# Altium schematic sheet Proyecto_Multicapa_Schematic_3.SchDoc
size Letter; SheetNumber: 3; SheetTotal: 3
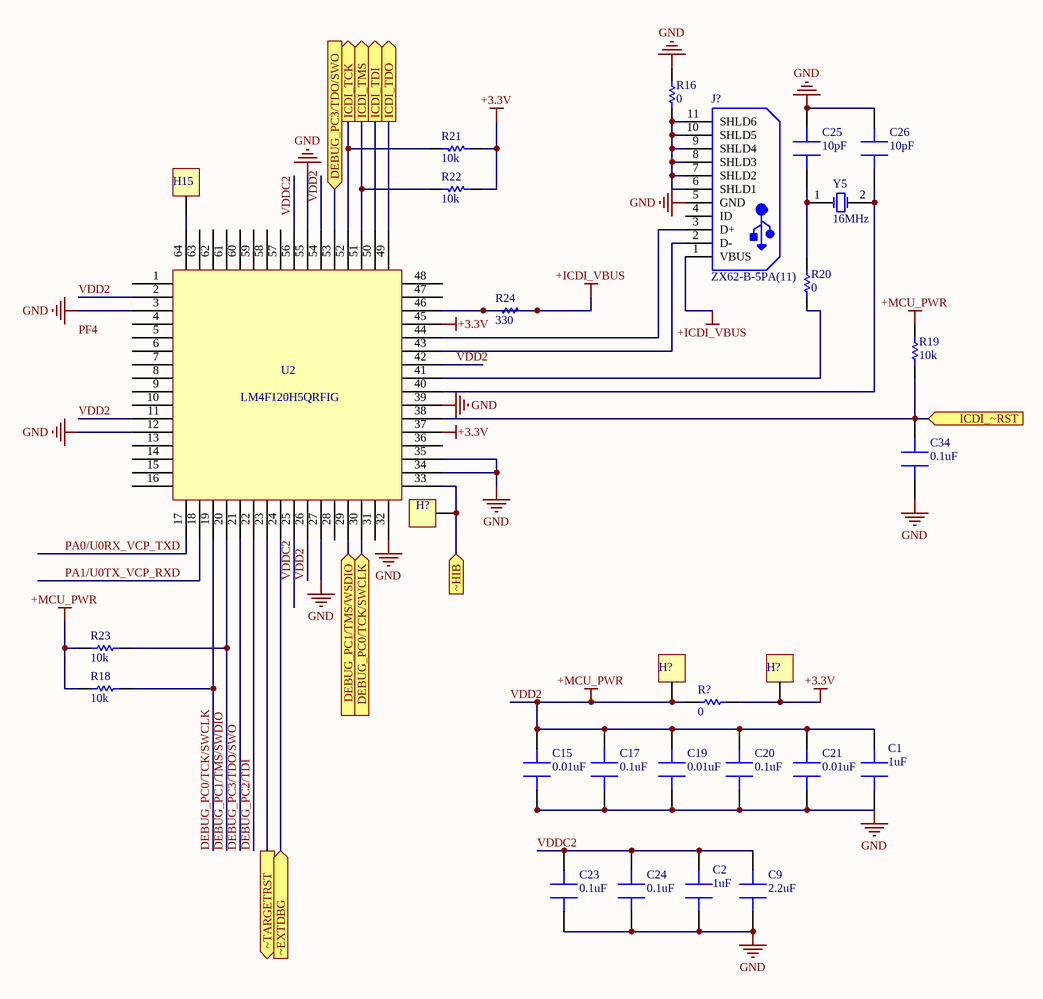
[diagram p0: Proyecto_Multicapa_Schematic_3.SchDoc]

## Parts
(Parts that share a designator on the sheet are numbered #1, #2 ... from top to bottom, then left to right.)
C1  1uF  [C0402]
C2  1uF  [C0402]
C9  2.2uF  [C0603]
C15  0.01uF  [C0402]
C17  0.1uF  [C0402]
C19  0.01uF  [C0402]
C20  0.1uF  [C0402]
C21  0.01uF  [C0402]
C23  0.1uF  [C0402]
C24  0.1uF  [C0402]
C25  10pF  [C0402]
C26  10pF  [C0402]
C34  0.1uF  [C0402]
H15  HDR1  [HDR 1X1]  (value not drawn)
H?#1  HDR1  [HDR 1X1]  (value not drawn)
H?#2  HDR1  [HDR 1X1]  (value not drawn)
H?#3  HDR1  [HDR 1X1]  (value not drawn)
J?  ZX62-B-5PA(11)  [HIRO-ZX62-B-5PA_V]
R16  0  [Resis 1M]
R18  10k  [Resis 1M]
R19  10k  [Resis 1M]
R20  0  [Resis 1M]
R21  10k  [Resis 1M]
R22  10k  [Resis 1M]
R23  10k  [Resis 1M]
R24  330  [Resis 1M]
R?  0  [Resis 1M]
U2  LM4F120H5QRFIG  [LM4F120H5QRFIG]  (value not drawn)
Y5  16MHz  [Crystal 16Mhz]

## Ports
DEBUG_PC0/TCK/SWCLK (in), DEBUG_PC1/TMS/WSDIO (in), DEBUG_PC3/TDO/SWO (in), ICDI_TCK (out), ICDI_TDI (out), ICDI_TDO (out), ICDI_TMS (out), ICDI_~RST (in), ~EXTDBG (in), ~HIB (in), ~TARGETRST (out)

## Nets
+3.3V: H?#3.1 R21.1 R22.1 R?.2 U2.37 U2.45
+ICDI_VBUS: J?.1(VBUS) R24.1 R24.2 U2.46
GND: C1.0 C2.0 C9.0 C15.0 C17.0 C19.0 C20.0 C21.0 C23.0 C24.0 C25.1 C26.1 C34.0 J?.5(GND) R16.1 U2.3 U2.12 U2.27 U2.32 U2.34 U2.35 U2.39 U2.55
VDD2: C1.1 C15.1 C17.1 C19.1 C20.1 C21.1 H?#2.1 R18.1 R19.2 R23.1 R?.1 U2.2 U2.11 U2.26 U2.42 U2.54  [also labelled +MCU_PWR]
DEBUG_PC0/TCK/SWCLK: R18.2 U2.19
DEBUG_PC0/TCK/SWCLK: U2.30 ; port DEBUG_PC0/TCK/SWCLK  [a separate net that carries the same name]
DEBUG_PC1/TMS/SWDIO: R23.2 U2.20
DEBUG_PC1/TMS/WSDIO: U2.29 ; port DEBUG_PC1/TMS/WSDIO
DEBUG_PC2/TDI: U2.22
DEBUG_PC3/TDO/SWO: U2.21
DEBUG_PC3/TDO/SWO: U2.53 ; port DEBUG_PC3/TDO/SWO  [a separate net that carries the same name]
ICDI_TCK: R21.2 U2.52 ; port ICDI_TCK
ICDI_TDI: U2.50 ; port ICDI_TDI
ICDI_TDO: U2.49 ; port ICDI_TDO
ICDI_TMS: R22.2 U2.51 ; port ICDI_TMS
ICDI_~RST: C34.1 R19.1 U2.38 ; port ICDI_~RST
PA0/U0RX_VCP_TXD: U2.17
PA1/U0TX_VCP_RXD: U2.18
VDDC2: C2.1 C9.1 C23.1 C24.1 U2.25 U2.56
~EXTDBG: U2.24 ; port ~EXTDBG
~HIB: H?#1.1 U2.33 ; port ~HIB
~TARGETRST: U2.23 ; port ~TARGETRST
NetC25_0: C25.0 R20.2 Y5.1(OSC1)
NetC26_0: C26.0 U2.40 Y5.2(OSC2)
NetH15_1: H15.1 U2.64
NetJ?_2: J?.2(D-) U2.43
NetJ?_3: J?.3(D+) U2.44
NetJ?_6: J?.6(SHLD1) J?.7(SHLD2) J?.8(SHLD3) J?.9(SHLD4) J?.10(SHLD5) J?.11(SHLD6) R16.2
NetR20_1: R20.1 U2.41

Not connected (* = marked no-connect by the designer): J? 4(ID); U2 1 4 5 6 7 8 9 10 13 14 15 16 28 31 36 47 48 57 58 59 60 61 62 63

## Notes on the sheet
- Labels drawn without touching a wire or pin: PF4
- Project:
- Page content:
- Revision:
- Size:
- Letter
- Design:
- Document Number:
- Date:
- Sheet:
- of

## Library data of the parts
C1 C2 = 100R07X105KV4T: Multilayer Ceramic Capacitor, Tanceram Series, 1 - F, - 10%, X5R, 10 V, 0402 [1005 Metric]; Manufacturer: Johanson; Voltage Rating: 10V; Supplier 1: Mouser; Manufacturer Part Number: 100R07X105KV4T; Stock 1: 61365; Pricing 1: 1 = 0.28000, 10 = 0.19300, 50 = 0.19300, 100 = 0.09800, 500 = 0.06700, 1000 = 0.06000, 2500 = 0.05700, 5000 = 0.05200, 10000 = 0.04800 (USD); RoHS: Yes; Mount: Surface Mount; Case/Package: 0402; Number of Pins: 2; Case Code (Metric): 1005; Case Code (Imperial): 0402; Weight: 2.3E-05oz; Min Operating Temperature: -55°C; Max Operating Temperature: 85°C; Capacitance: 1uF; Tolerance: 10%; Packaging: Tape and Reel; Package Quantity: 10000; Voltage Rating (DC): 10V; Dielectric: X5R; Termination: SMD/SMT; Series: TANCERAM®; Length: 1.02mm; Width: 0.02inch; Height: 0.64mm; Thickness: 0.025inch; Depth: 0.51mm; Radiation Hardening: No; REACH SVHC: No SVHC; RoHS Compliant: Yes; ComponentLink1URL: https://datasheet.ciiva.com/26948/getdatasheetpartid-789067-26948543.pdf?src-supplier=Verical; ComponentLink1Description: https://datasheet.ciiva.com/26948/getdatasheetpartid-789067-26948543.pdf?src-supplier=Verical; ComponentLink2URL: https://datasheet.ciiva.com/22693/jdi-full-catalog-2012-01-22693744.pdf?src-supplier=Element14; ComponentLink2Description: https://datasheet.ciiva.com/22693/jdi-full-catalog-2012-01-22693744.pdf?src-supplier=Element14; Supplier Part Number 1: 605-100R07X105KV4T
C9 = GRM188R61C225KE15D: 0603 2.2 uF 16 V ±10% Tolerance X5R SMT Multilayer Ceramic Capacitor; Manufacturer: Murata; Voltage Rating: 16V; Supplier 1: Arrow Electronics; Manufacturer Part Number: GRM188R61C225KE15D; Stock 1: 80000; Pricing 1: 4000 = 0.07480, 8000 = 0.06840, 12000 = 0.05830, 20000 = 0.05480, 24000 = 0.05360, 100000 = 0.05210 (USD); RoHS: Yes; Mount: Surface Mount; Case/Package: 0603; Case Code (Imperial): 0603; Case Code (Metric): 1608; Material: Ceramic; Min Operating Temperature: -55°C; Max Operating Temperature: 85°C; Capacitance: 2.2uF; Tolerance: 10%; Dielectric: X5R; Voltage Rating (DC): 16V; Packaging: Tape and Reel; Package Quantity: 1; Termination: SMD/SMT; Voltage: 16V; Length: 1.6mm; Width: 0.8mm; Height: 0.8mm; Thickness: 0.035inch; Depth: 0.8mm; Radiation Hardening: No; RoHS Compliant: Yes; Lead Free: Lead Free; REACH SVHC: No SVHC; ComponentLink1URL: https://datasheet.ciiva.com/135/grm188r61c225ke15-01-135062.pdf?src-supplier=Digi-Key; ComponentLink1Description: https://datasheet.ciiva.com/135/grm188r61c225ke15-01-135062.pdf?src-supplier=Digi-Key; ComponentLink2URL: https://datasheet.ciiva.com/135/grm188r61c225ke15-01-135063.pdf?src-supplier=Digi-Key; ComponentLink2Description: https://datasheet.ciiva.com/135/grm188r61c225ke15-01-135063.pdf?src-supplier=Digi-Key; ComponentLink3URL: https://datasheet.ciiva.com/5417/product-5417088.pdf?src-supplier=Mouser; ComponentLink3Description: https://datasheet.ciiva.com/5417/product-5417088.pdf?src-supplier=Mouser; ComponentLink4URL: https://datasheet.ciiva.com/3777/147grm188r61c225ke1523-3777042.pdf?src-supplier=Arrow+Electronics; ComponentLink4Description: https://datasheet.ciiva.com/3777/147grm188r61c225ke1523-3777042.pdf?src-supplier=Arrow+Electronics; ComponentLink5URL: https://datasheet.ciiva.com/29199/454457-da-01-en-vs-kondensator-0603-29199689.pdf?src-supplier=Conrad; ComponentLink5Description: https://datasheet.ciiva.com/29199/454457-da-01-en-vs-kondensator-0603-29199689.pdf?src-supplier=Conrad; ComponentLink6URL: https://datasheet.ciiva.com/135/grm188r61c225ke15-01-135061.pdf?src-supplier=Digi-Key; ComponentLink6Description: https://datasheet.ciiva.com/135/grm188r61c225ke15-01-135061.pdf?src-supplier=Digi-Key; ComponentLink7URL: https://datasheet.ciiva.com/16369/product-16369274.pdf?src-supplier=Future+Electronics; ComponentLink7Description: https://datasheet.ciiva.com/16369/product-16369274.pdf?src-supplier=Future+Electronics; Supplier Part Number 1: GRM188R61C225KE15D
C15 C19 C21 = TMK105B7103KV-F: 0402 0.01 uF 25 V ±10% X7R Automotive Multilayer Ceramic Capacitor; Manufacturer: Taiyo Yuden; Capacitance: 10nF; Voltage Rating: 25V; Supplier 1: Newark; Manufacturer Part Number: TMK105B7103KV-F; Stock 1: 2; Pricing 1: 1 = 0.00200, 25 = 0.00200, 100 = 0.00200, 250 = 0.00200, 500 = 0.00200, 1000 = 0.00200, 2500 = 0.00200, 5000 = 0.00200 (USD); RoHS: Yes; Mount: Surface Mount; Case/Package: 0402; Case Code (Metric): 1005; Case Code (Imperial): 0402; Contact Plating: Tin; Min Operating Temperature: -55°C; Max Operating Temperature: 125°C; Tolerance: 10%; Package Quantity: 1; Packaging: Tape and Reel; Voltage Rating (DC): 25V; Dielectric: X7R; Termination: SMD/SMT; Resistor Type: Ceramic; Series: M; Construction: Flat; Voltage: 25V; Length: 1mm; Width: 0.02inch; Height: 0.5mm; Thickness: 0.022inch; Depth: 0.5mm; REACH SVHC: Unknown; Halogen Free: Halogen Free; RoHS Compliant: Yes; ComponentLink1URL: https://datasheet.ciiva.com/129/tmk105b7103kv-f-ss-129699.pdf?src-supplier=Digi-Key; ComponentLink1Description: https://datasheet.ciiva.com/129/tmk105b7103kv-f-ss-129699.pdf?src-supplier=Digi-Key; ComponentLink2URL: https://datasheet.ciiva.com/30192/438tmk105b7103kv-f-30192315.pdf?src-supplier=Onlinecomponents.com; ComponentLink2Description: https://datasheet.ciiva.com/30192/438tmk105b7103kv-f-30192315.pdf?src-supplier=Onlinecomponents.com; ComponentLink3URL: https://datasheet.ciiva.com/15922/204tmk105b7103kv-f-15922348.pdf?src-supplier=Onlinecomponents.com; ComponentLink3Description: https://datasheet.ciiva.com/15922/204tmk105b7103kv-f-15922348.pdf?src-supplier=Onlinecomponents.com; ComponentLink4URL: https://datasheet.ciiva.com/30156/190tmk105b7103kv-f-30156174.pdf?src-supplier=Onlinecomponents.com; ComponentLink4Description: https://datasheet.ciiva.com/30156/190tmk105b7103kv-f-30156174.pdf?src-supplier=Onlinecomponents.com; ComponentLink5URL: https://datasheet.ciiva.com/28645/746258-28645254.pdf?src-supplier=Element14; ComponentLink5Description: https://datasheet.ciiva.com/28645/746258-28645254.pdf?src-supplier=Element14; ComponentLink6URL: https://datasheet.ciiva.com/7975/746258-7975835.pdf?src-supplier=Element14; ComponentLink6Description: https://datasheet.ciiva.com/7975/746258-7975835.pdf?src-supplier=Element14; Supplier Part Number 1: 77M8496
C17 C20 C23 C24 C34 = EMK105B7104KV-F: 0402 0.1 uF 16 V ±10% Tolerance X7R Multilayer Ceramic Chip Capacitor; Manufacturer: Taiyo Yuden; Capacitance: 100nF; Voltage Rating (DC): 16V; Supplier 1: RSComponents; Manufacturer Part Number: EMK105B7104KV-F; Stock 1: 30000; Pricing 1: 10000 = 0.00300 (GBP); RoHS: Yes; Mount: Surface Mount; Case/Package: 0402; Number of Pins: 2; Case Code (Metric): 1005; Case Code (Imperial): 0402; Min Operating Temperature: -55°C; Max Operating Temperature: 125°C; Tolerance: 10%; Packaging: Tape and Reel; Dielectric: X7R; Package Quantity: 1; Voltage Rating: 16V; Termination: SMD/SMT; Series: M; Construction: Flat; Resistor Type: Ceramic; Length: 1mm; Width: 0.02inch; Height: 0.5mm; Thickness: 0.022inch; Depth: 0.5mm; Radiation Hardening: No; Halogen Free: Halogen Free; REACH SVHC: Unknown; RoHS Compliant: Yes; Lead Free: Lead Free; ComponentLink1URL: https://datasheet.ciiva.com/129/emk105b7104kv-f-ss-129714.pdf?src-supplier=Digi-Key; ComponentLink1Description: https://datasheet.ciiva.com/129/emk105b7104kv-f-ss-129714.pdf?src-supplier=Digi-Key; ComponentLink2URL: https://datasheet.ciiva.com/30227/emk105b7104kv-f-30227394.pdf?src-supplier=Onlinecomponents.com; ComponentLink2Description: https://datasheet.ciiva.com/30227/emk105b7104kv-f-30227394.pdf?src-supplier=Onlinecomponents.com; ComponentLink3URL: https://datasheet.ciiva.com/22748/746258-22748959.pdf?src-supplier=Element14; ComponentLink3Description: https://datasheet.ciiva.com/22748/746258-22748959.pdf?src-supplier=Element14; Supplier Part Number 1: 1721352
C25 C26 = GRM1555C1H100JZ01D: Cap Ceramic 10pF 50V C0G 5% SMD 0402 125°C Paper T/R; Manufacturer: Murata; Insulation Resistance: 10GR; Temperature Coefficient: 30ppm/°C; Supplier 1: Farnell; Manufacturer Part Number: GRM1555C1H100JZ01D; Stock 1: 0; Pricing 1: 1 = 37.68000, 3 = 28.53000 (GBP); RoHS: Yes; Mount: Surface Mount; Case/Package: 0402; Number of Pins: 2; Case Code (Imperial): 0402; Case Code (Metric): 1005; Dielectric Material: Ceramic; Min Operating Temperature: -55°C; Max Operating Temperature: 125°C; Capacitance: 10pF; Tolerance: 5%; Dielectric: C0G; Voltage Rating: 50V; Voltage Rating (DC): 50V; Packaging: Tape and Reel; Package Quantity: 1; Termination: SMD/SMT; Voltage: 50V; Series: GRM; Construction: Flat; Length: 1mm; Width: 0.5mm; Height: 0.5mm; Thickness: 0.022inch; Depth: 0.5mm; Size: 0.5mm; Radiation Hardening: No; REACH SVHC: No SVHC; Lead Free: Lead Free; RoHS Compliant: Yes; ComponentLink1URL: https://datasheet.ciiva.com/129/partnumbering-e-01-129819.pdf?src-supplier=Digi-Key; ComponentLink1Description: https://datasheet.ciiva.com/129/partnumbering-e-01-129819.pdf?src-supplier=Digi-Key; ComponentLink2URL: https://datasheet.ciiva.com/129/partnumbering-e-01-129820.pdf?src-supplier=Digi-Key; ComponentLink2Description: https://datasheet.ciiva.com/129/partnumbering-e-01-129820.pdf?src-supplier=Digi-Key; ComponentLink3URL: https://datasheet.ciiva.com/129/partnumbering-e-01-129821.pdf?src-supplier=Digi-Key; ComponentLink3Description: https://datasheet.ciiva.com/129/partnumbering-e-01-129821.pdf?src-supplier=Digi-Key; ComponentLink4URL: https://datasheet.ciiva.com/19476/1855887-19476237.pdf?src-supplier=Jameco; ComponentLink4Description: https://datasheet.ciiva.com/19476/1855887-19476237.pdf?src-supplier=Jameco; ComponentLink5URL: https://datasheet.ciiva.com/18184/getdatasheetpartid-91958-18184166.pdf?src-supplier=Verical; ComponentLink5Description: https://datasheet.ciiva.com/18184/getdatasheetpartid-91958-18184166.pdf?src-supplier=Verical; ComponentLink6URL: https://datasheet.ciiva.com/11787/0900766b807a1cab-11787097.pdf?src-supplier=RSComponents; ComponentLink6Description: https://datasheet.ciiva.com/11787/0900766b807a1cab-11787097.pdf?src-supplier=RSComponents; ComponentLink7URL: https://datasheet.ciiva.com/6068/1747431-6068159.pdf?src-supplier=Farnell; ComponentLink7Description: https://datasheet.ciiva.com/6068/1747431-6068159.pdf?src-supplier=Farnell; ComponentLink8URL: https://datasheet.ciiva.com/11607/c02e-11607480.pdf?src-supplier=Avnet; ComponentLink8Description: https://datasheet.ciiva.com/11607/c02e-11607480.pdf?src-supplier=Avnet; ComponentLink9URL: https://datasheet.ciiva.com/14116/grmseries-tc-hitype-eng-14116856.pdf?src-supplier=Distrelec; ComponentLink9Description: https://datasheet.ciiva.com/14116/grmseries-tc-hitype-eng-14116856.pdf?src-supplier=Distrelec; ComponentLink10URL: https://datasheet.ciiva.com/14116/grmseries-tc-hitype-eng-14116917.pdf?src-supplier=Distrelec; ComponentLink10Description: https://datasheet.ciiva.com/14116/grmseries-tc-hitype-eng-14116917.pdf?src-supplier=Distrelec; ComponentLink11URL: https://datasheet.ciiva.com/7828/1747431-7828813.pdf?src-supplier=Element14; ComponentLink11Description: https://datasheet.ciiva.com/7828/1747431-7828813.pdf?src-supplier=Element14; ComponentLink12URL: https://datasheet.ciiva.com/7828/1747431-7828815.pdf?src-supplier=Element14; ComponentLink12Description: https://datasheet.ciiva.com/7828/1747431-7828815.pdf?src-supplier=Element14; Supplier Part Number 1: 1118131
H15 H?#1-H?#3 = Header 1x1: Header 1x1, hole
J? = CMP-2000-05146-1: Micro USB-B Receptacle Connector, Right Angle, 30 V, -30 to 85 degC, 5-Pin SMD, RoHS, Tape and Reel; Manufacturer: Hirose Electric; DELETED: Compliant; Voltage Rating Max: 30VAC; Number of Contacts: 5POS; Pitch (mm): 0.65mm; Current Rating (Max): 1/ContactA; Gender: RCP; Product Depth (mm): 5.6mm; Product Length (mm): 7.9mm; Product Diameter (mm): NotRequiredmm; Number of Ports: 1Port; Product Height (mm): 2.8mm; Body Orientation: RightAngle; Datasheet Version: Jul-08; Packaging: TapeandReel; Mounting Style: SurfaceMount; Datasheet URL: https://datasheet.ciiva.com/11731/0900766b80d9c4df-11731324.pdf; Package Reference: ZX62-B-5PA; Termination Method: Solder; Number of Terminals: 5; Operating Temp Range: -30Cto85C; Type: MicroUSBTypeB; Contact Material: CopperAlloy; Manufacturer URL: https://www.hirose.com; Contact Plating: Gold; Package Description: 5-Pin Surface Mount Device, Body 7.9 x 5 mm, Pitch 0.65 mm; Operating Temperature Min Deg. C: -30C; Operating Temperature Max Deg. C: 85C
R16 R18-R24 R? = MCR01MRTF1004: Res Thick Film 0402 1M Ohm 1% 0.063W(1/16W) ±100ppm/C Pad SMD T/R; Manufacturer: Rohm; Resistance: 1MR; Max Power Dissipation: 63mW; Temperature Coefficient: 100ppm/°C; Voltage Rating (DC): 50V; Supplier 1: Digi-Key; Manufacturer Part Number: MCR01MRTF1004; Stock 1: 0; RoHS: Yes; Case/Package: 0402; Case Code (Metric): 1005; Case Code (Imperial): 0402; Min Operating Temperature: -55°C; Max Operating Temperature: 155°C; Package Quantity: 1; Tolerance: 1%; Packaging: Tape and Reel; Resistor Type: Thick Film; Number of Terminations: 2; Series: MCR; Length: 0.039inch; Width: 0.02inch; Height: 0.016inch; Lead Free: Lead Free; RoHS Compliant: Yes; ComponentLink1URL: https://datasheet.ciiva.com/2519/mcr01mrt-seriesspec-2519945.pdf?src-supplier=Digi-Key; ComponentLink1Description: https://datasheet.ciiva.com/2519/mcr01mrt-seriesspec-2519945.pdf?src-supplier=Digi-Key; ComponentLink2URL: https://datasheet.ciiva.com/2519/mcr01mrt-seriesspec-2519946.pdf?src-supplier=Digi-Key; ComponentLink2Description: https://datasheet.ciiva.com/2519/mcr01mrt-seriesspec-2519946.pdf?src-supplier=Digi-Key; ComponentLink3URL: https://datasheet.ciiva.com/2519/mcr01mrt-seriesspec-2519947.pdf?src-supplier=Digi-Key; ComponentLink3Description: https://datasheet.ciiva.com/2519/mcr01mrt-seriesspec-2519947.pdf?src-supplier=Digi-Key; Supplier Part Number 1: RHM1.00MCDCT-ND
U2 = LM4F120H5QRFIG: MCU 32-bit Stellaris ARM Cortex M4F RISC 256KB Flash 1.2V/3.3V 64-Pin LQFP Tray; Manufacturer: Texas Instruments; RAM Size: 32KB; Max Power Dissipation: 560mW; Interface: I2C,USB,CAN,UART; Number of Timers/Counters: 13; Data Bus Width: 32b; Number of Programmable I/O: 43; Watchdog Timer: Yes; Max Frequency: 80MHz; Supplier 1: Arrow Electronics; Manufacturer Part Number: LM4F120H5QRFIG; Stock 1: 0; RoHS: Yes; Case/Package: LQFP; Min Operating Temperature: -40°C; Max Operating Temperature: 85°C; Packaging: Tray; Memory Type: FLASH; Memory Size: 256KB; Core Architecture: ARM; Radiation Hardening: No; RoHS Compliant: Yes; ComponentLink1URL: http://www.ti.com/lit/ds/symlink/lm4f120h5qr.pdf?src-supplier=Avnet; ComponentLink1Description: http://www.ti.com/lit/ds/symlink/lm4f120h5qr.pdf?src-supplier=Avnet; Supplier Part Number 1: LM4F120H5QRFIG
Y5 = ABM3-16.000MHZ-B2-T: Crystal 16MHz ±20ppm (Tol) ±50ppm (Stability) 18pF FUND 40Ohm 2-Pin Mini-CSMD T/R; Manufacturer: Abracon; ESR (Equivalent Series Resistance): 40R; Series Resistance: 60R; Supplier 1: Digi-Key; Manufacturer Part Number: ABM3-16.000MHZ-B2-T; Stock 1: 0; Pricing 1: 1 = 0.95000, 10 = 0.83900, 50 = 0.78440, 100 = 0.69310, 500 = 0.65664 (USD); RoHS: Yes; Mount: Surface Mount; Case/Package: CSMD; Number of Pins: 2; Min Operating Temperature: -20°C; Max Operating Temperature: 70°C; Frequency: 16MHz; Load Capacitance: 18pF; Packaging: Tape and Reel; Frequency Tolerance: 20ppm; Package Quantity: 1000; Tolerance: 20ppm; Frequency Stability: 50ppm; Termination: SMD/SMT; Resistor Type: Ceramic; Accuracy: 20ppm; Series: ABM3; Operating Frequency: 16 MHz; Length: 5mm; Width: 3.2mm; Height: 0.051inch; Depth: 3.2mm; REACH SVHC: Yes; Lead Free: Lead Free; ComponentLink1URL: https://datasheet.ciiva.com/15116/getdatasheetpartid-719852-15116752.pdf?src-supplier=Verical; ComponentLink1Description: https://datasheet.ciiva.com/15116/getdatasheetpartid-719852-15116752.pdf?src-supplier=Verical; ComponentLink2URL: https://datasheet.ciiva.com/855/abm3-855737.pdf?src-supplier=Digi-Key; ComponentLink2Description: https://datasheet.ciiva.com/855/abm3-855737.pdf?src-supplier=Digi-Key; ComponentLink3URL: https://datasheet.ciiva.com/855/abm3-855738.pdf?src-supplier=Digi-Key; ComponentLink3Description: https://datasheet.ciiva.com/855/abm3-855738.pdf?src-supplier=Digi-Key; ComponentLink4URL: https://datasheet.ciiva.com/855/abm3-855739.pdf?src-supplier=Digi-Key; ComponentLink4Description: https://datasheet.ciiva.com/855/abm3-855739.pdf?src-supplier=Digi-Key; ComponentLink5URL: https://datasheet.ciiva.com/4945/abm3-47699-4945240.pdf?src-supplier=Mouser; ComponentLink5Description: https://datasheet.ciiva.com/4945/abm3-47699-4945240.pdf?src-supplier=Mouser; ComponentLink6URL: https://datasheet.ciiva.com/16209/abm3-16209965.pdf?src-supplier=Future+Electronics; ComponentLink6Description: https://datasheet.ciiva.com/16209/abm3-16209965.pdf?src-supplier=Future+Electronics; Supplier Part Number 1: 535-9103-6-ND